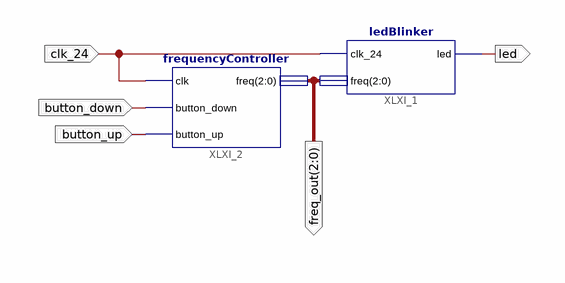
[diagram p0: schematic sheet 1]
// Xilinx ISE schematic wholeDesign.sch (spartan6) as structural Verilog: 2 symbols, 5 ports
module wholeDesign (
  input  clk_24,
  input  button_down,
  input  button_up,
  output [2:0] freq_out,
  output led
);

  ledBlinker XLXI_1 (.clk_24(clk_24), .freq(freq_out), .led(led));
  frequencyController XLXI_2 (.clk(clk_24), .button_down(button_down), .button_up(button_up), .freq(freq_out));
endmodule
